# EAGLE design grove_pi (EAGLE 6.5.0)
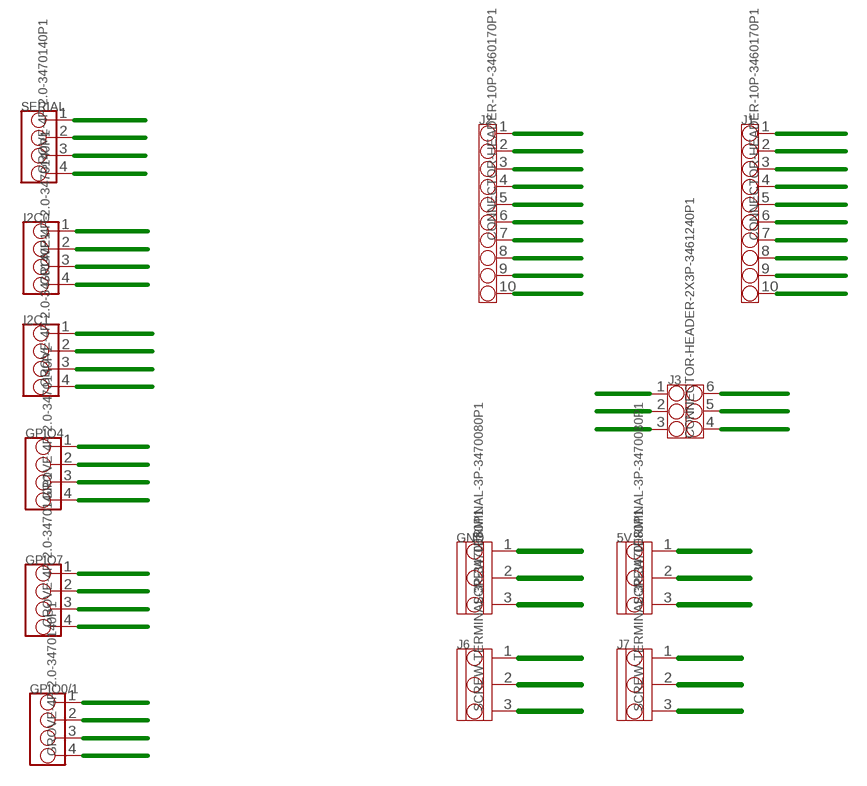
[diagram p0: schematic, sheet 1]

## Parts
5V  SCREW-TERMINAL-3P-3470080P1  [3P-5.0]
GND  SCREW-TERMINAL-3P-3470080P1  [3P-5.0]
GPIO0/1  GROVE-4P-2.0-3470140P1  [4P-2.0-90D]
GPIO4  GROVE-4P-2.0-3470140P1  [4P-2.0-90D]
GPIO7  GROVE-4P-2.0-3470140P1  [4P-2.0-90D]
I2C0  GROVE-4P-2.0-3470140P1  [4P-2.0-90D]
I2C1  GROVE-4P-2.0-3470140P1  [4P-2.0-90D]
J1  CONNECTOR-HEADER-10P-3460170P1  [1X10P-2.54-8.5-YELLOW-FEMALE]
J2  CONNECTOR-HEADER-10P-3460170P1  [1X10P-2.54-8.5-YELLOW-FEMALE]
J3  CONNECTOR-HEADER-2X3P-3461240P1  [2X3P-2.54-8.5+1.5-12.3-BLUE-FEMALE]
J6  SCREW-TERMINAL-3P-3470080P1  [3P-5.0]
J7  SCREW-TERMINAL-3P-3470080P1  [3P-5.0]
SERIAL  GROVE-4P-2.0-3470140P1  [4P-2.0-90D]

## Nets
3V3: J1.1
5V: 5V.1 5V.2 5V.3 GPIO0/1.3 GPIO4.3 GPIO7.3 I2C0.3 I2C1.3 J2.1 SERIAL.3
CE0(SPI): J3.5
CE1(SPI): J3.4
DNC: J2.2
DNC1: J1.5
DNC2: J2.7
DNC3: J2.10
DNC4: J1.9
DNC5: J3.3
GND: GND.1 GND.2 GND.3 GPIO0/1.4 GPIO4.4 GPIO7.4 I2C0.4 I2C1.4 J2.3 SERIAL.4
GPIO0: GPIO0/1.1 J1.6
GPIO1: GPIO0/1.2 J2.6 J6.1
GPIO2: J1.7 J6.2
GPIO3: J1.8 J6.3
GPIO4: GPIO4.1 GPIO4.2 J2.8 J7.1
GPIO5: J2.9 J7.2
GPIO6: J3.6 J7.3
GPIO7: GPIO7.1 GPIO7.2 J1.4
MISO(SPI): J3.1
MOSI(SPI): J1.10
RXD: J2.5 SERIAL.1
SCL0(I2C): I2C0.1 I2C1.1 J1.3
SCLK(SPI): J3.2
SDA0(I2C): I2C0.2 I2C1.2 J1.2
TXD: J2.4 SERIAL.2

## Library data of the parts
5V GND J6 J7 = OPL Eagle Library:SCREW-TERMINAL-3P
GPIO0/1 GPIO4 GPIO7 I2C0 I2C1 SERIAL = OPL Eagle Library:GROVE-4P-2.0
J1 J2 = OPL Eagle Library:CONNECTOR-HEADER-10P
J3 = OPL Eagle Library:CONNECTOR-HEADER-2X3P

## Board
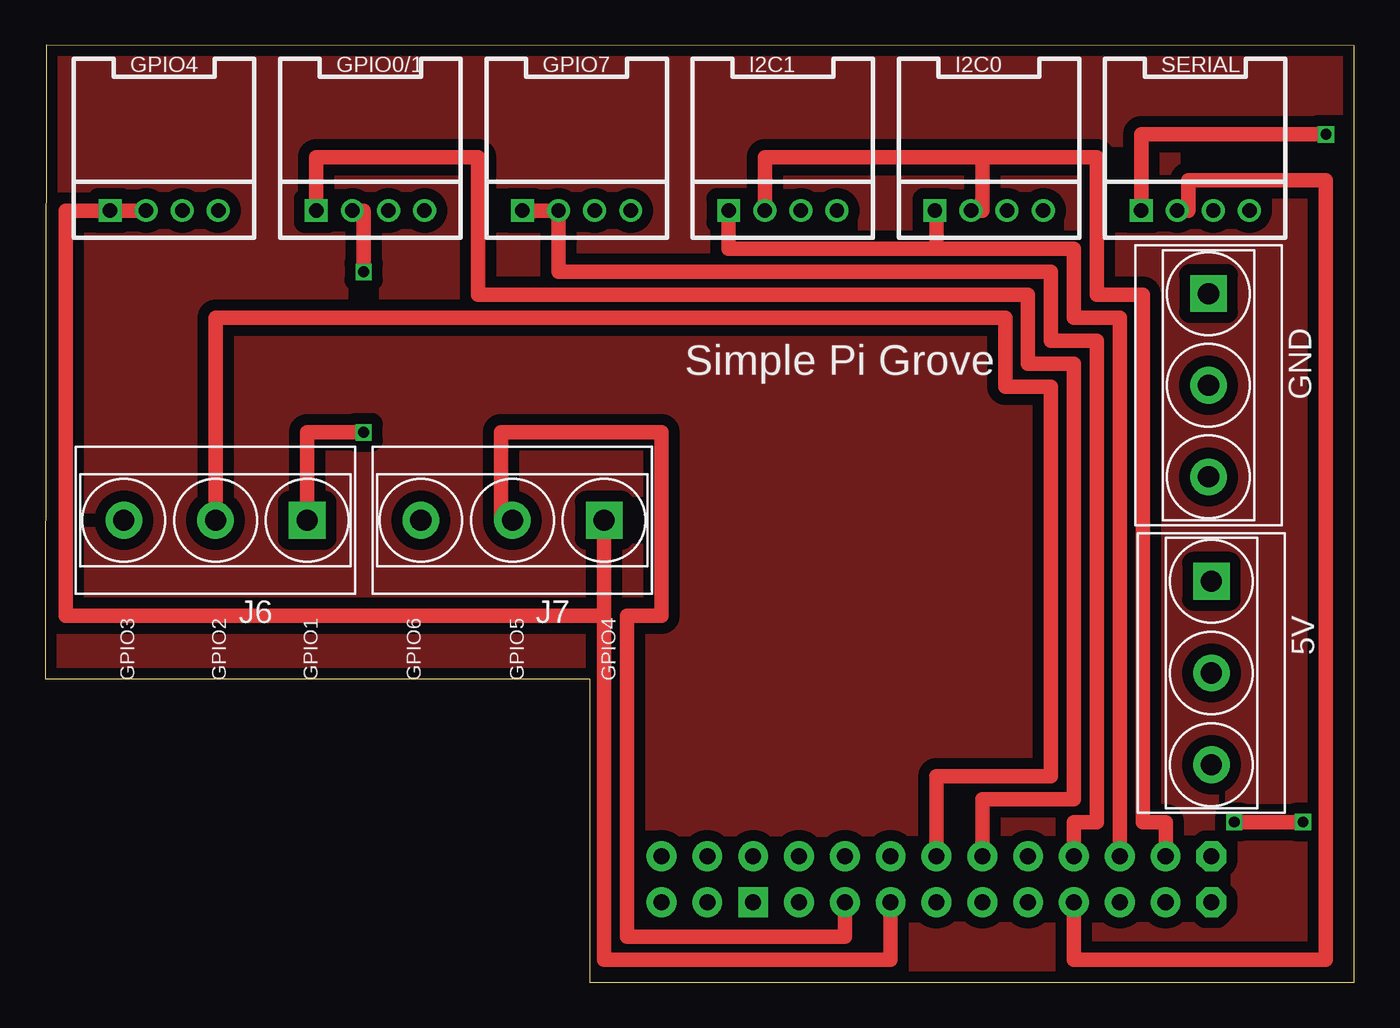
[diagram p1: board, top side]
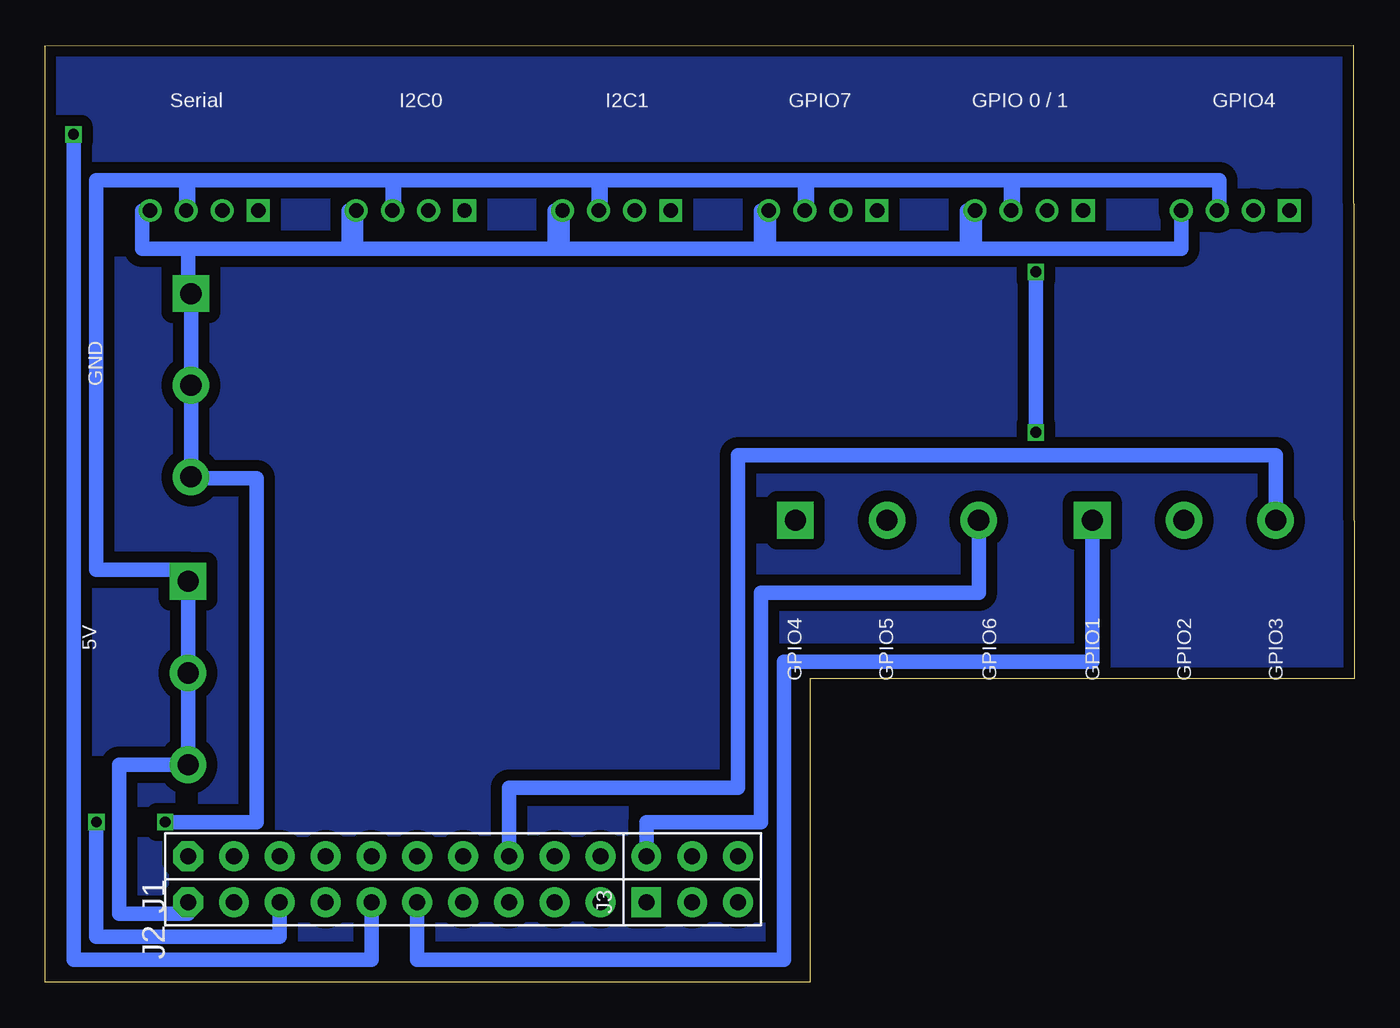
[diagram p2: board, bottom side, seen from below]

Size 72.57 x 51.94 mm. Coordinates in mm from the lower left corner, seen from the top.
Outline: 0,16.82 30.19,16.82 30.19,0 72.57,0 72.57,51.91 0.05,51.94 0,16.82
Copper layers (1*2*15*16): Top 0.035mm / dielectric 0.2mm / layer 2 0.0175mm / dielectric 1.1mm / layer 15 0.0175mm / dielectric 0.2mm / Bottom 0.035mm
Design rules "SeeedStudio_DRU_no_angle_20130527": minimum track width 6mil, minimum drill 12mil, track to track 6mil, track to pad 6mil, pad to pad 6mil, via to via 6mil, smd to smd 0mil, copper to edge 10mil, drill to drill 10mil, minimum pad ring 6mil, minimum via ring 6mil, stop-mask expansion 2mil, vias tented up to drill 25mil, thermal gap 10mil

### Footprints (pad centres in the part's own frame; a part is rotated, then mirrored left to right if it is on the bottom)
3P-5.0 = drill 1.168 pad 2.032 square: 1 -5.08,0 | drill 1.168 pad 2.032: 2 0,0; 3 5.08,0
4P-2.0-90D = drill 0.8 pad 1.27 square: 1 -3,0 | drill 0.8 pad 1.27: 2 -1,0; 3 1,0; 4 3,0
1X10P-2.54-8.5-YELLOW-FEMALE = drill 0.889 pad 1.651 octagon: 1 0,11.43 | drill 0.889 pad 1.651: 2 0,8.89; 3 0,6.35; 4 0,3.81; 5 0,1.27; 6 0,-1.27; 7 0,-3.81; 8 0,-6.35; 9 0,-8.89; 10 0,-11.43
2X3P-2.54-8.5+1.5-12.3-BLUE-FEMALE = drill 0.889 pad 1.651 square: 1 -1.27,2.54 | drill 0.889 pad 1.651: 2 -1.27,0; 3 -1.27,-2.54; 4 1.27,-2.54; 5 1.27,0; 6 1.27,2.54

### Placement (x,y rotation side)
5V  64.64,17.14 270 top
GND  64.48,33.09 270 top
GPIO0/1  18.03,42.77 0 top
GPIO4  6.6,42.77 0 top
GPIO7  29.46,42.77 0 top
I2C0  52.32,42.77 0 top
I2C1  40.89,42.77 0 top
J1  53.22,6.99 90 bottom
J2  53.22,4.45 90 bottom
J3  36.7,5.71 90 bottom
J6  9.45,25.61 180 top
J7  25.91,25.61 180 top
SERIAL  63.75,42.77 0 top

### Tracks (layer width: path | path; a pad name or v marks a point on that pad's centre or on a via)
5V
  Bottom 0.813: J2.1 64.64,3.81 68.45,3.81 68.45,12.06 5V.3 5V.2 5V.1 64.64,22.86 69.72,22.86 69.72,44.45 64.64,44.45 64.64,42.77 SERIAL.3 64.75,44.45 53.22,44.45 53.22,42.77 I2C0.3 53.32,44.45 41.79,44.45 41.79,42.77 I2C1.3 41.89,44.45 30.36,44.45 30.36,42.77 GPIO7.3 30.46,44.45 18.93,44.45 18.93,42.77 GPIO0/1.3 19.03,44.45 7.5,44.45 7.5,42.77 GPIO4.3
GND  (via drill 0.6)
  Top 0.813: v65.91,8.89 v69.72,8.89
  Bottom 0.813: GPIO4.4 9.6,40.64 21.46,40.64 21.46,42.77 GPIO0/1.4 21.03,40.64 32.9,40.64 32.9,42.77 GPIO7.4 32.46,40.64 44.33,40.64 44.33,42.77 I2C1.4 43.89,40.64 55.76,40.64 55.76,42.77 I2C0.4 55.32,40.64 64.64,40.64 | SERIAL.4 67.18,42.77 67.18,40.64 64.64,40.64 | 64.64,40.64 64.64,38.17 GND.1 GND.2 GND.3 64.48,27.94 60.84,27.94 60.84,8.89 v65.91,8.89 | v69.72,8.89 69.72,2.54 59.56,2.54 J2.3
GPIO0
  Top 0.813: J1.6 51.95,10.16 57.02,10.16 57.02,34.29 54.48,34.29 54.48,38.1 24.01,38.1 24.01,45.72 15.03,45.72 GPIO0/1.1
GPIO1  (via drill 0.6)
  Top 0.813: GPIO0/1.2 17.66,42.77 v17.66,39.37 | v17.66,30.48 14.53,30.48 J6.1
  Bottom 0.813: v17.66,39.37 v17.66,30.48 | J2.6 51.95,1.27 31.62,1.27 31.62,17.78 14.53,17.78 J6.1
GPIO2
  Top 0.813: J1.7 49.41,11.43 55.76,11.43 55.76,33.02 53.22,33.02 53.22,36.83 9.45,36.83 J6.2
GPIO3
  Bottom 0.813: J1.8 46.87,10.79 34.16,10.79 34.16,29.21 4.37,29.21 J6.3
GPIO4
  Top 0.813: GPIO4.1 GPIO4.2 1.15,42.77 1.15,20.32 30.98,20.32 | 30.98,20.32 J7.1 | J2.8 46.87,1.27 30.99,1.27 30.99,19.68 30.98,20.32
GPIO5
  Top 0.813: J7.2 25.28,25.61 25.28,30.48 34.16,30.48 34.16,20.32 32.26,20.32 32.26,2.54 44.33,2.54 J2.9
GPIO6
  Bottom 0.813: J3.6 39.24,8.89 32.9,8.89 32.9,21.59 20.82,21.59 J7.3
GPIO7
  Top 0.813: J1.4 57.02,8.89 58.3,8.89 58.3,35.56 55.76,35.56 55.76,39.37 28.46,39.37 GPIO7.2 GPIO7.1
N$1
  pour Top (isolate 0.61): 0.51,52.07 72.27,52.07 72.27,0.64 30.99,0.64 30.99,17.14 0.51,17.14
N$2
  pour Bottom (isolate 0.61): 0.51,52.07 72.27,52.07 72.27,0.64 30.99,0.64 30.99,17.14 0.51,17.14
RXD  (via drill 0.6)
  Top 0.813: v70.99,46.99 60.75,46.99 SERIAL.1
  Bottom 0.813: J2.5 54.48,1.27 70.99,1.27 v70.99,46.99
SCL0(I2C)
  Top 0.813: J1.3 59.56,36.83 57.02,36.83 57.02,40.64 49.41,40.64 | I2C0.1 49.41,42.77 49.41,40.64 | 49.41,40.64 37.89,40.64 I2C1.1
SDA0(I2C)
  Top 0.813: J1.2 62.1,8.89 60.84,8.89 60.84,38.1 58.3,38.1 58.3,45.72 51.95,45.72 | I2C0.2 51.95,42.77 51.95,45.72 | 51.95,45.72 39.89,45.72 I2C1.2
TXD
  Top 0.813: J2.4 57.02,1.27 70.99,1.27 70.99,44.45 63.38,44.45 63.38,42.77 SERIAL.2

### Text on the board
tNames: Simple Pi Grove | GPIO3 | GPIO2 | GPIO1 | GPIO6 | GPIO5 | GPIO4
bNames: GPIO4 | GPIO 0 / 1 | GPIO7 | I2C1 | I2C0 | Serial | GND | GPIO3 | GPIO2 | GPIO1 | GPIO6 | GPIO5 | GPIO4 | 5V